# Altium schematic sheet comms.SchDoc
size A4; Organization: Altium Limited; Address1: L3, 12a Rodborough Rd; Address2: Frenchs Forest; Address3: NSW; Address4: Australia 2086
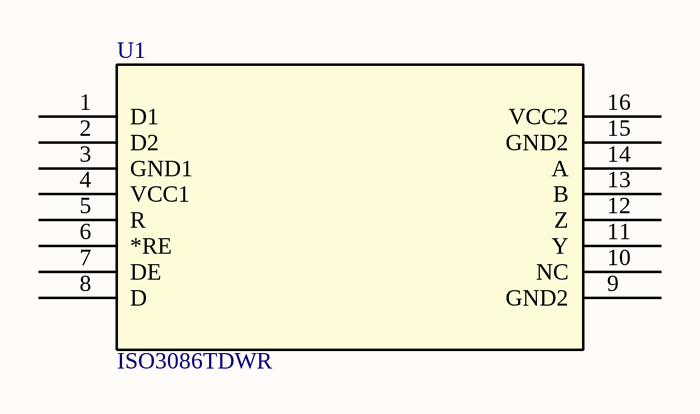
[diagram p0: comms.SchDoc]

## Parts
U1  ISO3086TDWR  [DW16]

## Nets

Not connected (* = marked no-connect by the designer): U1 1(D1) 2(D2) 3(GND1) 4(VCC1) 5(R) 6(*RE) 7(DE) 8(D) 9(GND2) 10(NC) 11(Y) 12(Z) 13(B) 14(A) 15(GND2) 16(VCC2)

## Notes on the sheet
- Title
- Size:
- Date:
- A4
- Number:
- Time:
- Revision:
- Sheet
- of
- File:

## Library data of the parts
U1 = ISO3086TDWR: Imported; Manufacturer: Texas Instruments; Built_By: EMA_UL_Team; C: Copyright (C) 2015 Accelerated Designs. All rights reserved; Vendor: Texas Instruments; Manufacturer_Part_Number: ISO3086TDWR; RefDes: RefDes; Type: DEV; Value: Value